# EasyEDA schematic ES Project.json
TITLE: Sheet_1; REV: 1.0; Date: 2025-03-23; Sheet: 1/1; Company: Your Company
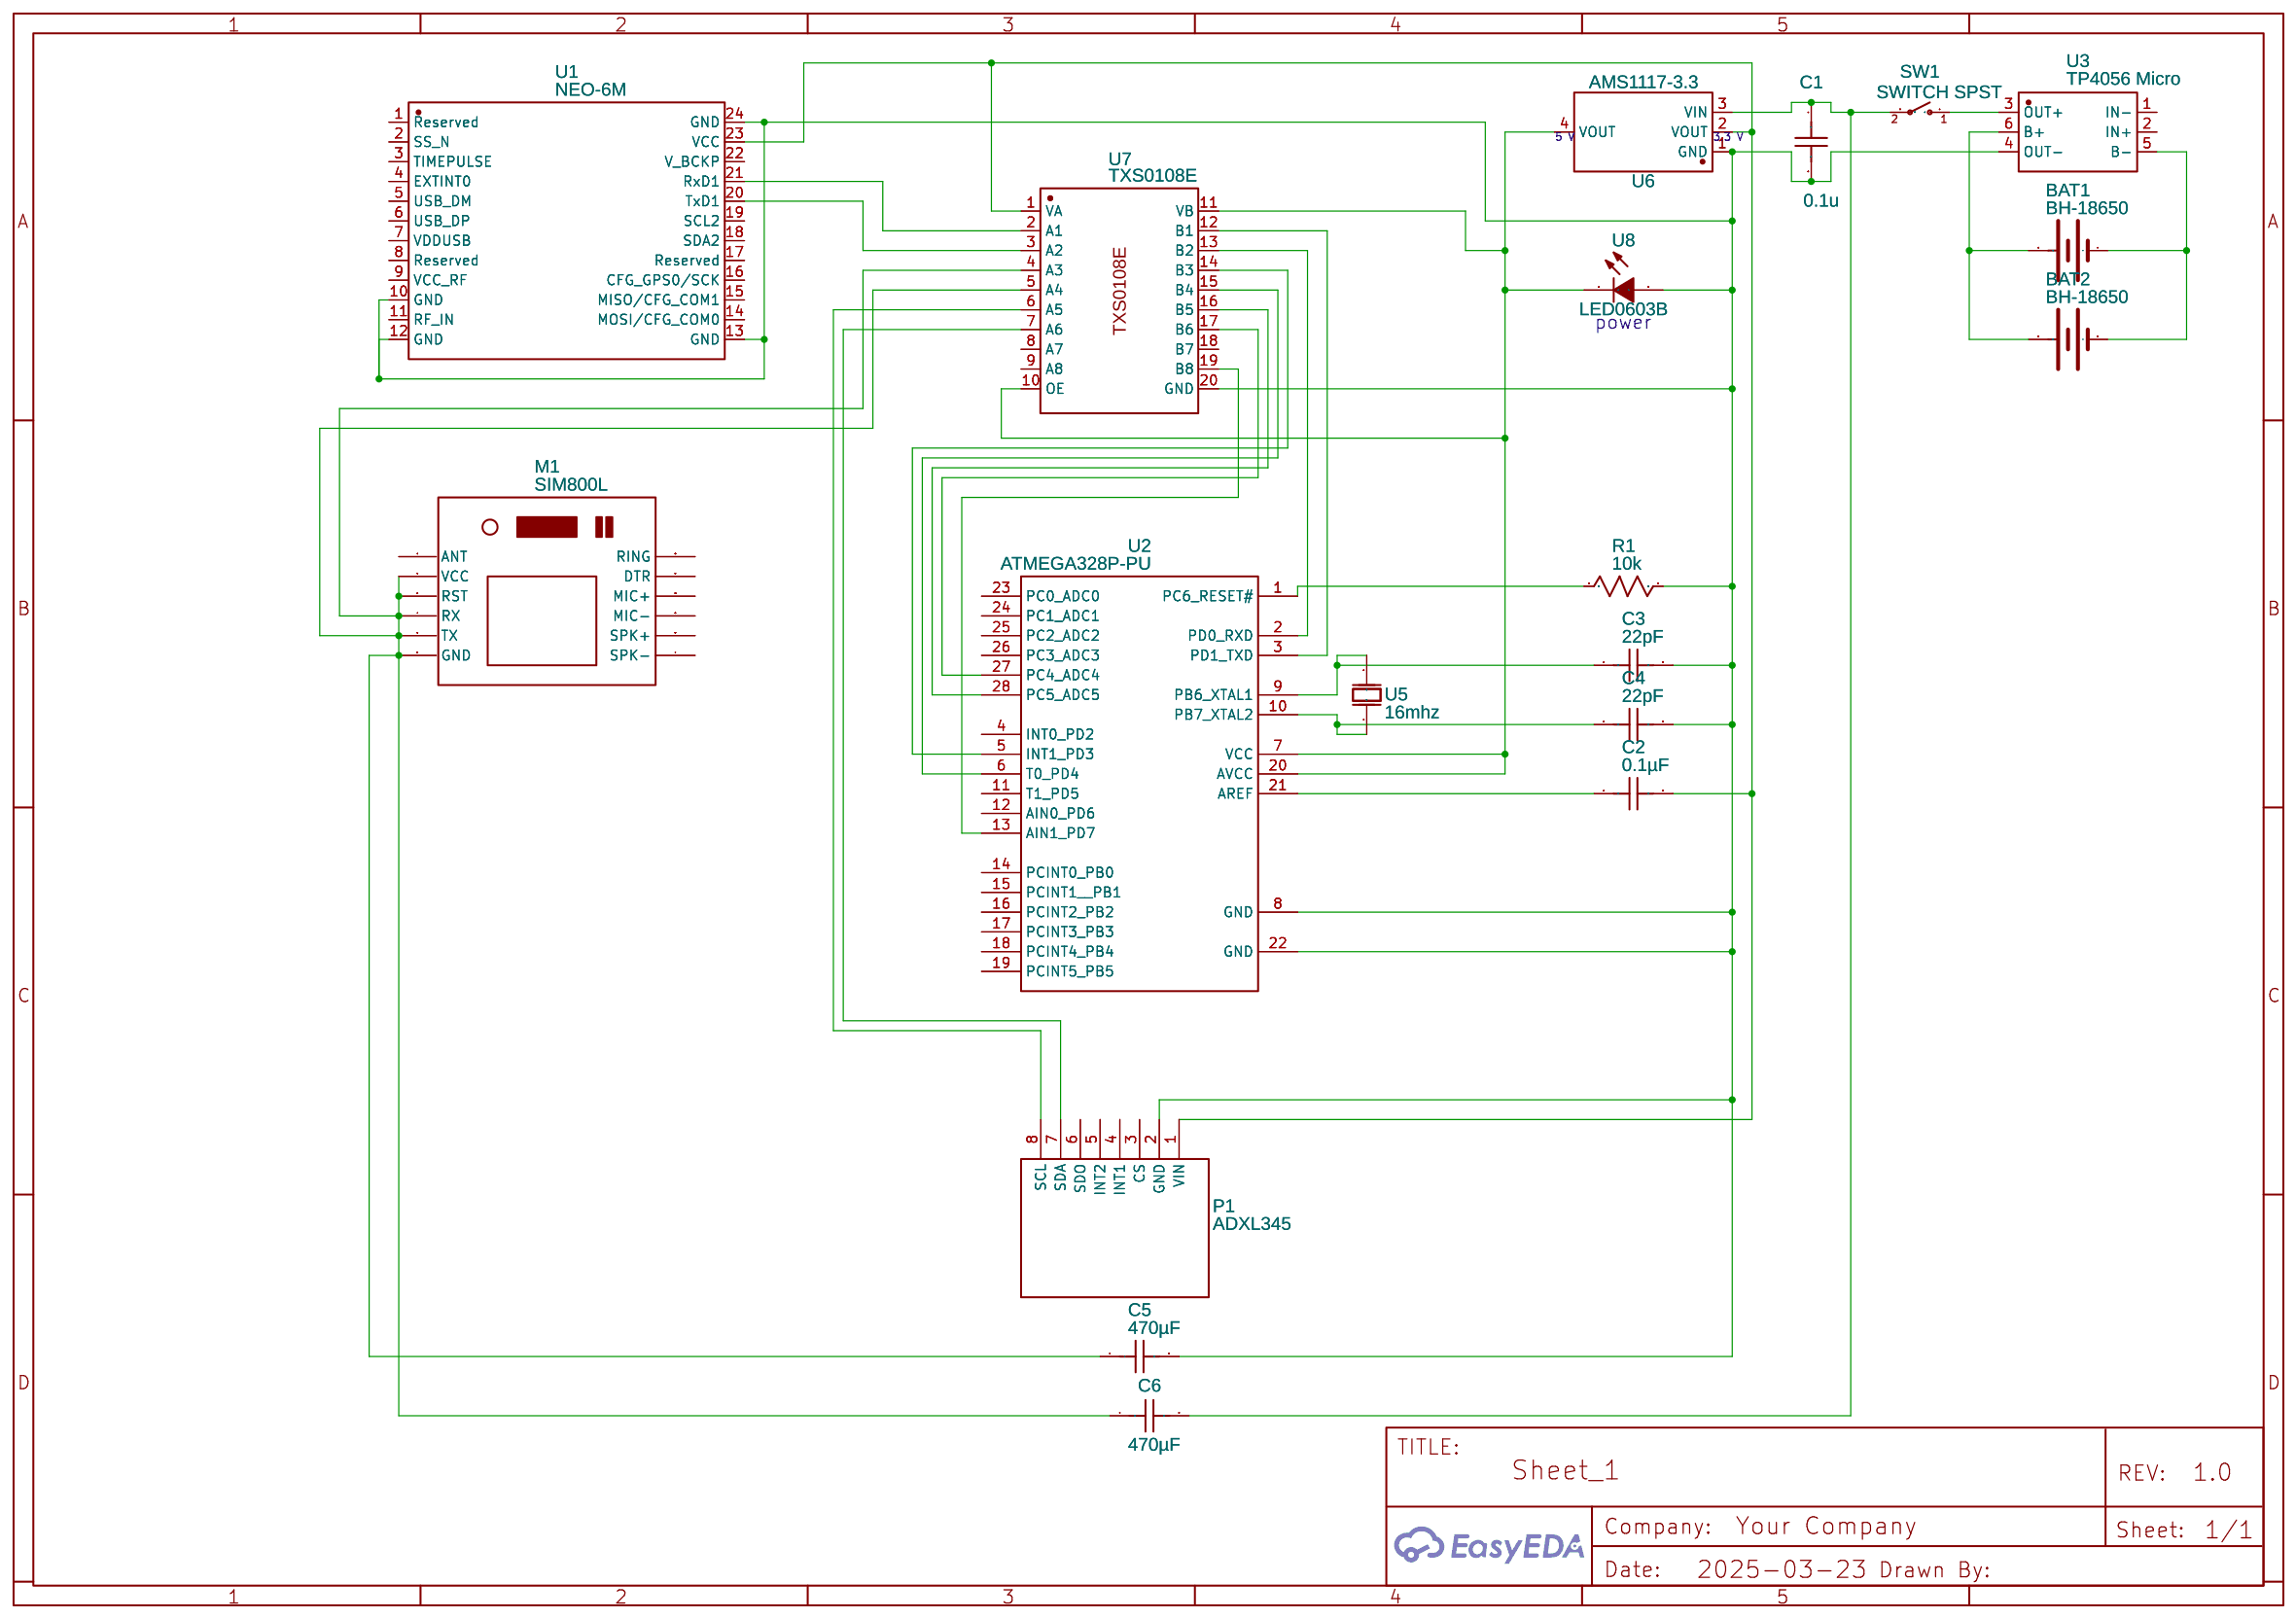
[diagram p0: schematic sheet]

## Parts
BAT1  BH-18650  [BAT-TH_BH-18650]
BAT2  BH-18650  [BAT-TH_BH-18650]
C1  0.1u  [C0603]
C2  0.1µF  [C0603]
C3  22pF  [C0603]
C4  22pF  [C0603]
C5  470µF  [C0603]
C6  470µF  [C0603]
M1  SIM800L  [SIM800LMODULE_SIM800LMODULE]
P1  ADXL345  [ADXL345]
R1  10k  [R0603]
SW1  SWITCH SPST  [TOGGLESWITCH SPST]
U1  NEO-6M  [GPSM-SMD_24P-L16.0-W12.2-P1.10]
U2  ATMEGA328P-PU  [DIP-28_L34.6-W7.3-P2.54-LS10.2-BL]
U3  TP4056 Micro  [TP4056 MICRO]
U5  16mhz  [16MHZCRYSTAL]
U6  AMS1117-3.3  [SOT-223-3_L6.5-W3.4-P2.30-LS7.0-BR]
U7  TXS0108E  [TXS0108E]
U8  LED0603B  [LED0603-RD]

## Library data of the parts
BAT1 BAT2 = BH-18650: Contributor: lcsc; Supplier: LCSC; Supplier Part: C9900017971; Manufacturer: null; JLCPCB Part Class: Extended Part
C1-C6 = C_0603_US: Contributor: LCEDA_Lib
M1 = SIM800L: Contributor: MINHHIEU16EA
P1 = ADXL345: sourceId: 1T5FDZYC8; Supplier Part: undefined; Supplier: AdaFruit; Contributor: JAVIER ANTONIO FÉLIX RUIZ
R1 = R_0603_US: Contributor: LCEDA_Lib
SW1 = SWITCH SPST: Contributor: SparkFun
U1 = NEO-6M: Contributor: LCSC; Supplier: LCSC; Supplier Part: C2927633; Manufacturer: null; JLCPCB Part Class: Extended Part
U2 = ATMEGA328P-PU: sourceId: Oic6oiASL; Contributor: LCSC; Supplier: LCSC; Manufacturer: MICROCHIP(美国微芯); Supplier Part: C33901; JLCPCB Part Class: Extended Part
U3 = TP4056 Micro: link: https://aliexpress.ru/item/1005001621934354.html; Contributor: mitoza
U5 = 16MHZCRYSTAL: Supplier: DeepSpace; Contributor: Igno magine
U6 = AMS1117-3.3: sourceId: dwIGgezVh; Supplier: LCSC; Manufacturer: AMS; Supplier Part: C6186
U7 = TXS0108E: link: https://uelectronics.com/wp-content/uploads/2018/07/Datasheet-TXS0108E.pdf; Contributor: aquisi
U8 = LED0603B: Contributor: LCSC; Supplier: LCSC; Supplier Part: C9900005354; Manufacturer: null; JLCPCB Part Class: Extended Part

## Nets
Net-(BAT1-1): BAT1.1(-) BAT2.1(-) U3.5(B-)
Net-(BAT1-2): BAT1.2(+) BAT2.2(+) U3.6(B+)
Net-(C1-1): C1.1 C6.2 SW1.2 U6.3(VIN)
Net-(C1-2): C1.2 C3.2 C4.2 C5.2 P1.2(GND) R1.2 U1.10(GND) U1.12(GND) U1.13(GND) U1.24(GND) U2.8(GND) U2.22(GND) U3.4(OUT-) U6.1(GND) U7.20(GND) U8.2(A)
Net-(C2-1): C2.1 U2.21(AREF)
Net-(C2-2): C2.2 P1.1(VIN) U1.23(VCC) U6.2(VOUT) U7.1(VA)
Net-(C3-1): C3.1 U2.9(PB6 XTAL1) U5.2
Net-(C4-1): C4.1 U2.10(PB7 XTAL2) U5.1
Net-(C5-1): C5.1 C6.1 M1.2(VCC) M1.3(RST) M1.4(RX) M1.5(TX) M1.6(GND) U7.4(A3) U7.5(A4)
Net-(P1-7): P1.7(SDA) U7.7(A6)
Net-(P1-8): P1.8(SCL) U7.6(A5)
Net-(R1-1): R1.1 U2.1(PC6 RESET#)
Net-(SW1-1): SW1.1 U3.3(OUT+)
Net-(U1-20): U1.20(TxD1) U7.3(A2)
Net-(U1-21): U1.21(RxD1) U7.2(A1)
Net-(U2-2): U2.2(PD0 RXD) U7.13(B2)
Net-(U2-3): U2.3(PD1 TXD) U7.12(B1)
Net-(U2-5): U2.5(INT1 PD3) U7.14(B3)
Net-(U2-6): U2.6(T0 PD4) U7.15(B4)
Net-(U2-7): U2.7(VCC) U2.20(AVCC) U6.4(VOUT) U7.10(OE) U7.11(VB) U8.1(K)
Net-(U2-13): U2.13(AIN1 PD7) U7.19(B8)
Net-(U2-27): U2.27(PC4 ADC4) U7.17(B6)
Net-(U2-28): U2.28(PC5 ADC5) U7.16(B5)

Not connected (* = marked no-connect by the designer): M1 1(ANT) 7(SPK-) 8(SPK+) 9(MIC-) 10(MIC+) 11(DTR) 12(RING); P1 3(CS) 4(INT1) 5(INT2) 6(SDO); U1 1(Reserved) 2(SS_N) 3(TIMEPULSE) 4(EXTINT0) 5(USB_DM) 6(USB_DP) 7(VDDUSB) 8(Reserved) 9(VCC_RF) 11(RF_IN) 14(MOSI/CFG_COM0) 15(MISO/CFG_COM1) 16(CFG_GPS0/SCK) 17(Reserved) 18(SDA2) 19(SCL2) 22(V_BCKP); U2 4(INT0 PD2) 11(T1 PD5) 12(AIN0 PD6) 14(PCINT0 PB0) 15(PCINT1  PB1) 16(PCINT2 PB2) 17(PCINT3 PB3) 18(PCINT4 PB4) 19(PCINT5 PB5) 23(PC0 ADC0) 24(PC1 ADC1) 25(PC2 ADC2) 26(PC3 ADC3); U3 1(IN-) 2(IN+); U7 8(A7) 9(A8) 18(B7)

## Notes on the sheet
- 5 V
- 3.3 V
- power
